# EasyEDA Pro project SRM_SuperCapacitor_S23_S24_.epro, board PCB1_3
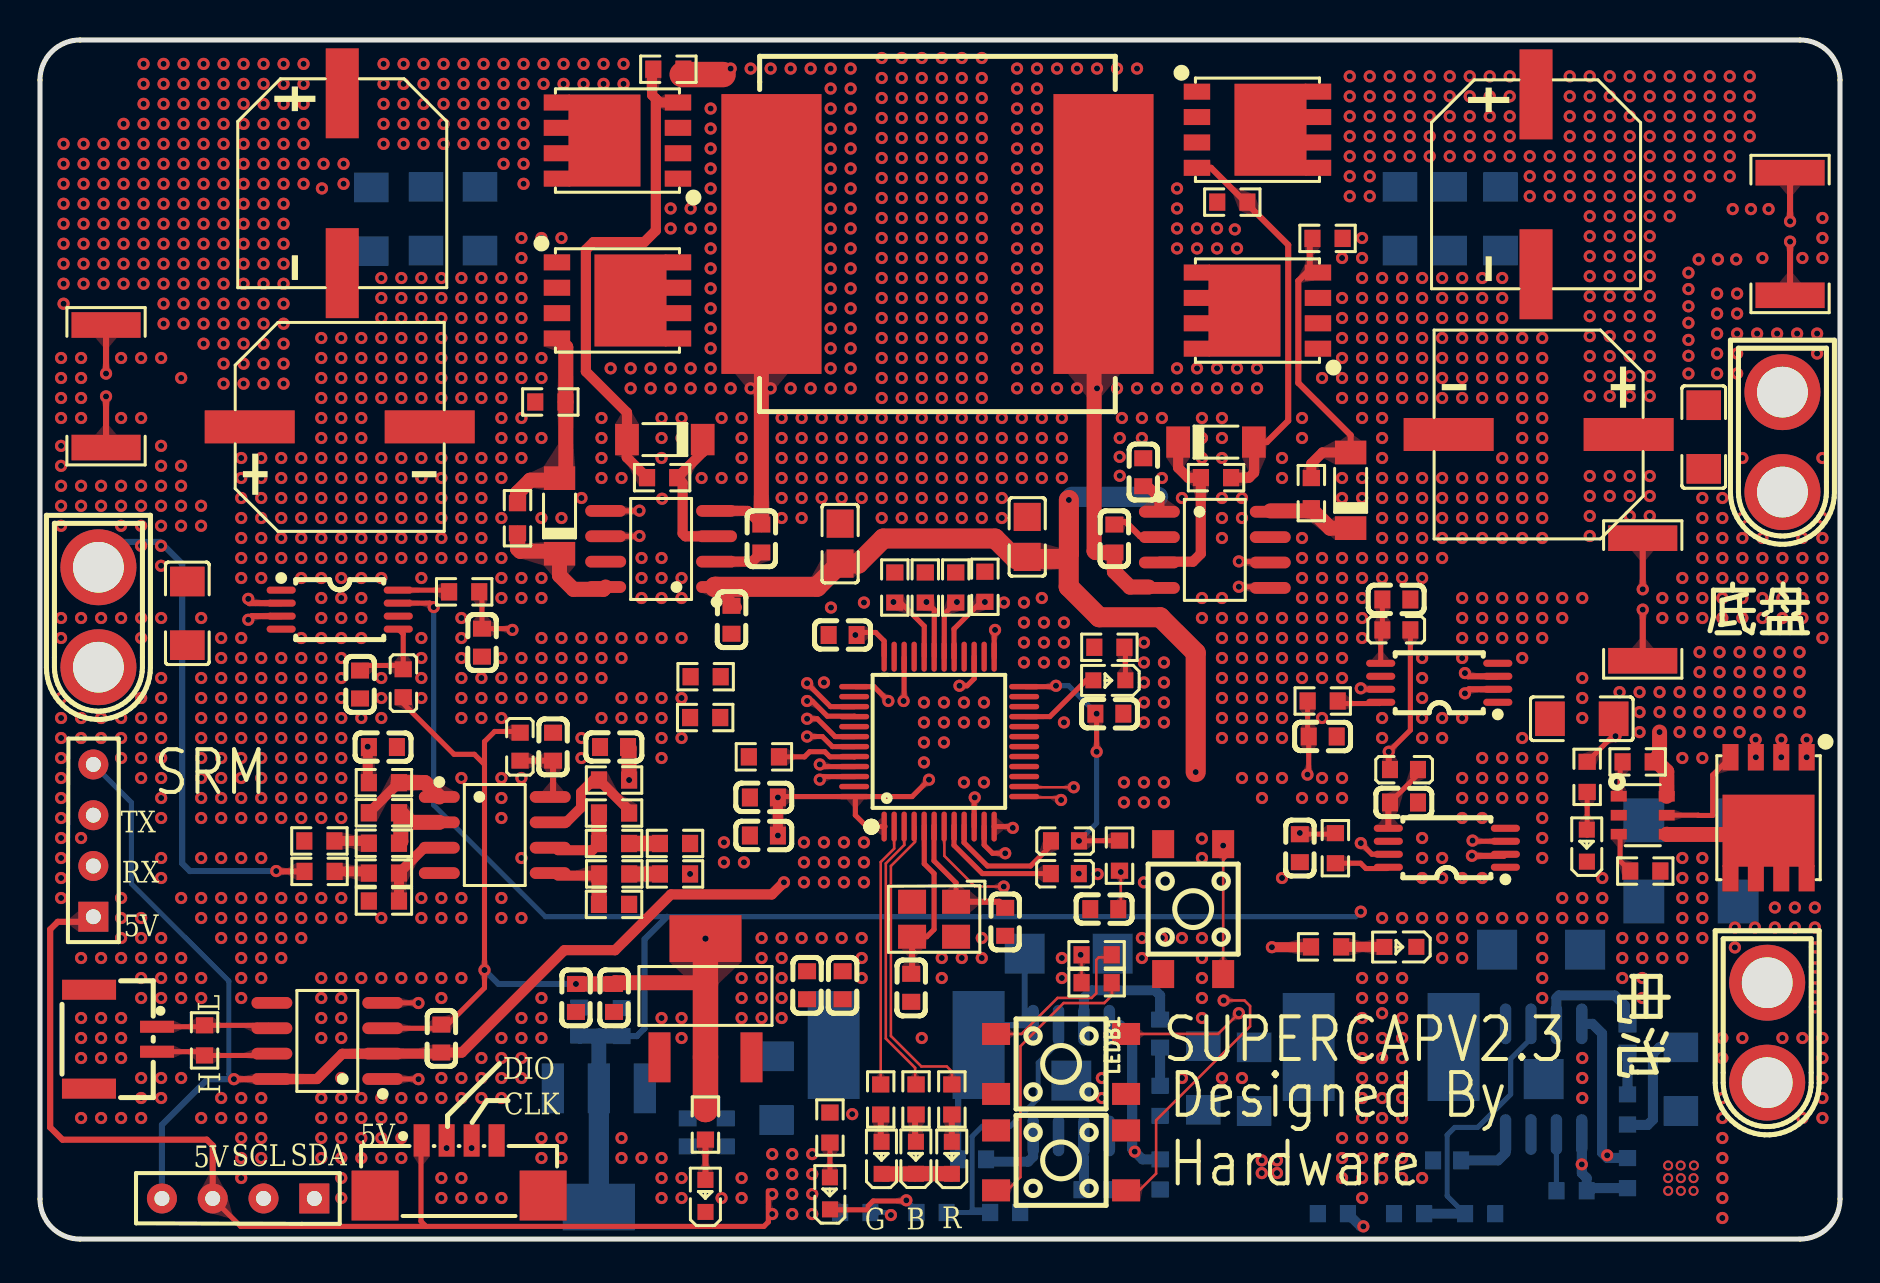
[diagram p3: board, top side]
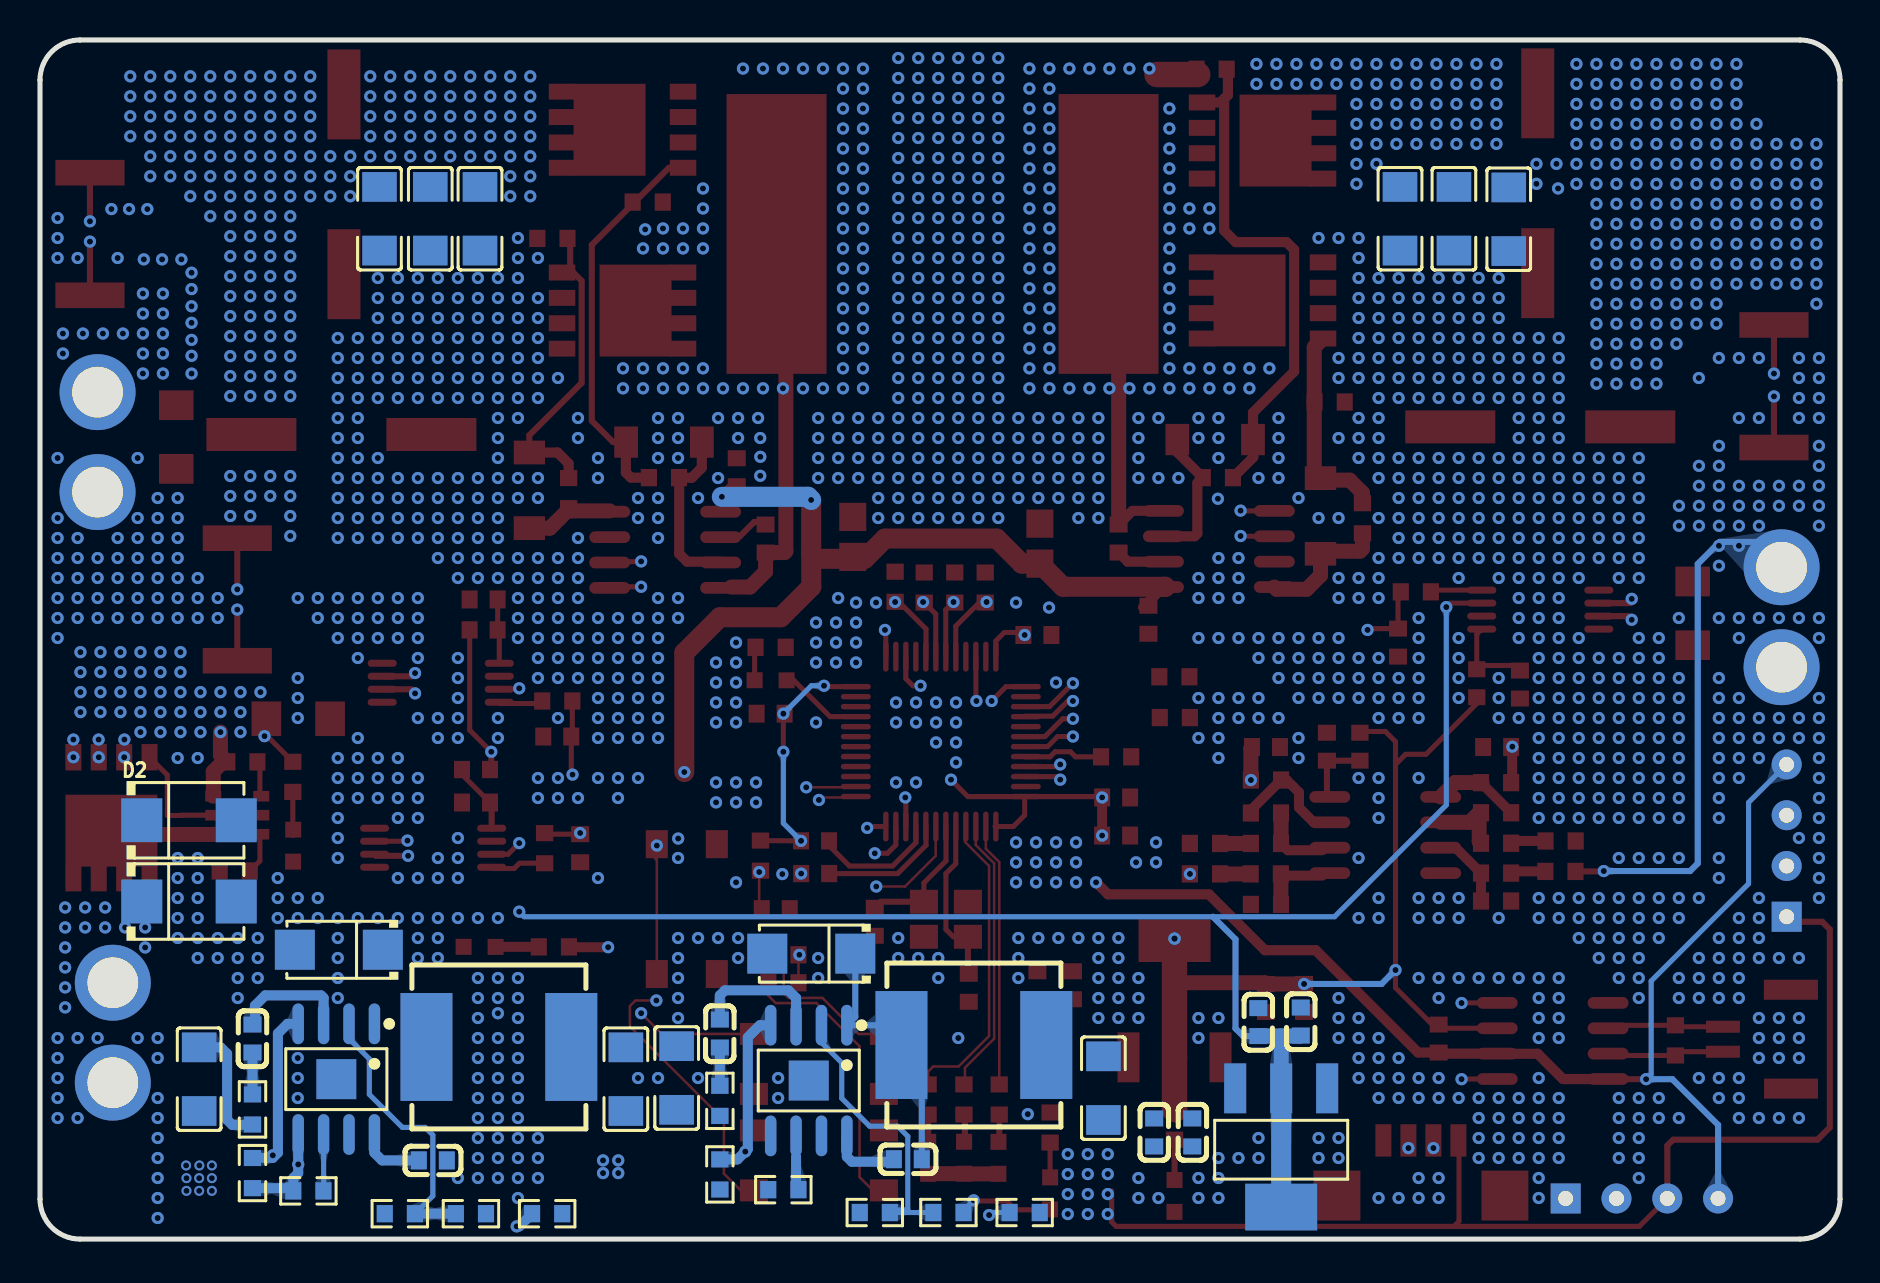
[diagram p4: board, bottom side, seen from below]

Outline 90 x 60 mm; copper layers: Top Layer, Inner1, Inner2, Bottom Layer. Coordinates in mm from the lower left corner of the outline.
Outline path: 0,58 0,2 arc(0.59,0.59) 2,0 88,0 arc(89.41,0.59) 90,2 90,58 arc(89.41,59.41) 88,60 2,60 arc(0.59,59.41) 0,58
Stack: Top Layer 0.035mm / Dielectric1 0.48mm PP er 4.5 / Inner1 0.035mm / Dielectric2 0.48mm FR4 er 4.5 / Inner2 0.035mm / Dielectric3 0.48mm PP er 4.5 / Bottom Layer 0.035mm

## Design rules (mm)
net INC-: DP7
net CAP_I+: DP8
net OUTC-: DP7
net CHB2: DP1
net CHB1: DP1
net CHA2: DP2
net UART2_RX: DP5
net CAN_RX: DP3
net UART2_TX: DP5
net CAN_TX: DP3
net SWCLK: DP4
net SWDIO: DP4
net CHA1: DP2
net SCL_PB6: DP6
net SDA_PB7: DP6
net CAP_I-: DP8
spacing safeClearance (default): track to track 0.102, other pairs 0.127 to 0.3
track width trackWidth (default): min 0.127, default 0.254, max 2.54
differential pair differentialPair (default): width min 0.025, default 0.254, max 2.54; gap min 0.025, default 0.152
via viaSize (default): diameter min 0.5, default 0.61, max 10; hole min 0.3, default 0.305, max 6

## Placement (name value [footprint] x y rotation side)
C1  100nF  [C0603]  20.07 10.03 270 top
C2  22pF  [C0603]  43.56 12.57 90 top
C3  22pF  [C0603]  48.26 15.87 90 top
C4  100nF  [C0603]  36.2 22.1 0 top
C5  100nF  [C0603]  40.13 30.23 0 top
C6  100nF  [C0603]  53.47 26.29 180 top
C7  100nF  [C0603]  36.2 20.19 0 top
C8  100nF  [C0603]  53.21 16.51 0 top
C9  150pF  [C0603]  56.01 10.28 90 bottom
C10  100nF  [C0603]  46.61 4 0 bottom
C11  22uF  [C1206]  36.83 7.55 270 bottom
C12  10uF  [C0603]  26.8 12.06 270 top
C13  100nF  [C0603]  28.7 12.06 270 top
C14  10uF  [C0603]  40.13 12.7 90 top
C15  100nF  [C0603]  38.35 12.7 90 top
C16  10uF  [C1206]  58.17 8.06 90 bottom
C17  100nF  [C0603]  32.39 5.33 270 bottom
C18  10uF  [C0603]  34.29 5.33 270 bottom
C19  100nF  [C0603]  26.96 10.89 90 bottom
C20  10uF  [C0603]  29.08 10.86 90 bottom
C24  100nF  [C0603]  64.14 25.15 0 top
C25  100nF  [C0603]  22.1 29.84 270 top
C26  100nF  [C0603]  62.99 19.56 270 top
C27  1uF  [C1206]  83.19 40.13 90 top
C28  100nF  [C0603]  67.82 32 0 top
C29  1uF  [C1206]  7.37 31.31 90 top
C30  100nF  [C0603]  16 27.75 270 top
C31  1uF  [C1206]  77.09 26.03 0 top
C32  100nF  [C0603]  68.2 21.84 0 top
C33  100nF  [C0603]  25.65 24.64 90 top
C34  47uF  [C1206]  19.3 51.05 90 bottom
C35  47uF  [C1206]  16.56 51.03 90 bottom
C36  47uF  [C1206]  22 51.05 90 bottom
C41  47uF  [C1206]  70.48 51.05 90 bottom
C42  47uF  [C1206]  73.02 51.05 90 bottom
C43  47uF  [C1206]  68 51.05 90 bottom
C44  100nF  [C0805]  40.01 34.8 270 top
C45  100nF  [C0805]  49.36 35.13 90 top
C46  1uF  [C0603]  36.07 35.05 90 top
C47  1uF  [C0603]  53.72 35.05 90 top
C48  150pF  [C0603]  79.38 10.03 90 bottom
C49  100nF  [C0603]  70.36 3.94 0 bottom
C50  22uF  [C1206]  60.71 8 270 bottom
C51  10uF  [C1206]  82.04 8 90 bottom
C52  100nF  [C0603]  17.14 24.62 180 top
C53  100nF  [C0603]  28.7 24.62 0 top
C54  220uF  [CAP-SMD_BD10.0-L10.3-W10.3-FD]  74.93 40.26 180 top
C55  220uF  [CAP-SMD_BD10.0-L10.3-W10.3-FD]  74.8 52.78 270 top
C56  220uF  [CAP-SMD_BD10.0-L10.3-W10.3-FD]  15.11 52.83 270 top
C57  220uF  [CAP-SMD_BD10.0-L10.3-W10.3-FD]  14.99 40.64 0 top
C58  100nF  [C0603]  55.16 38.37 270 top
C59  100nF  [C0603]  34.58 30.99 270 top
CN1  HC-1.25-4PLT  [CONN-SMD 4P-P1.25-L]  20.95 3.56 0 top
CN2  XT30U-M  [CONN-TH_XT30U-M]  2.92 31.11 270 top
CN3  XT30U-M  [CONN-TH_XT30U-M]  86.36 10.33 270 top
CN4  XT30U-M  [CONN-TH_XT30U-M]  87.12 39.88 270 top
D1  SS34  [SMA_L4.3-W2.6-LS5.2-RD]  51.44 14.28 0 bottom
D2  SMBJ28A  [SMB_L4.6-W3.6-LS5.3-RD]  82.55 20.95 180 bottom
D3  LL4148  [LL-34_L3.5-W1.5-R-RD]  31.24 40 180 top
D4  LL4148  [LL-34_L3.5-W1.5-R-RD]  58.8 39.88 0 top
D5  LL4148  [LL-34_L3.5-W1.5-R-RD]  25.98 36.18 90 top
D6  LL4148  [LL-34_L3.5-W1.5-R-RD]  65.53 37.46 90 top
D7  SS34  [SMA_L4.3-W2.6-LS5.2-RD]  75.06 14.48 0 bottom
D8  SMBJ28A  [SMB_L4.6-W3.6-LS5.3-RD]  82.55 16.89 180 bottom
L1  10mH  [L0603]  51.25 19.93 180 top
L2  10mH  [L0603]  51.24 18.29 180 top
L3  15uH  [IND-SMD_L8.2-W8.2]  43.31 9.71 0 bottom
L4  10mH  [L0603]  67.82 30.48 0 top
L5  10mH  [L0603]  18.16 27.81 270 top
L6  10mH  [L0603]  68.2 23.49 180 top
L7  10uH  [L0603]  24 24.64 90 top
L8  22uH  [IND-SMD_L17.5-W17.5]  44.87 50.29 0 top
L9  22uH  [IND-SMD_L8.2-W8.2]  67.06 9.61 0 bottom
LED1  -  [LED0603-RD_BLUE]  53.47 27.96 180 top
LED2  -  [LED0603-RD_BLUE]  77.34 19.68 90 top
LED3  -  [LED0603-RD_BLUE]  68.02 14.62 180 top
LED4  -  [LED0603-RD_BLUE]  39.5 2.29 90 top
LED5  -  [LED0603-RD_BLUE]  33.27 2.16 90 top
LEDB1  -  [LED0603-RD_BLUE]  45.59 4.06 90 top
LEDG1  -  [LED0603-RD_BLUE]  43.8 4.07 90 top
LEDR1  -  [LED0603-RD_BLUE]  42.08 4.06 90 top
Q1  CSD19534Q5A  [POWERVDFN-8_L6.0-W5.0-P1.27-BL]  28.87 54.97 90 top
Q2  CSD19534Q5A  [POWERVDFN-8_L6.0-W5.0-P1.27-BL]  60.87 55.51 270 top
Q3  CSD19534Q5A  [POWERVDFN-8_L6.0-W5.0-P1.27-BL]  28.87 46.97 270 top
Q4  CSD19534Q5A  [POWERVDFN-8_L6.0-W5.0-P1.27-BL]  60.87 46.46 90 top
Q5  CSD19534Q5A  [POWERVDFN-8_L6.0-W5.0-P1.27-BL]  86.43 21.08 180 top
R1  120R  [R0603]  8.23 9.94 270 top
R2  10K  [R0603]  36.2 24.13 180 top
R3  10K  [R0603]  53.47 29.61 180 top
R4  10K  [R0603]  53.98 19.19 90 top
R5  1K  [R0603]  42.04 6.98 90 top
R6  1K  [R0603]  43.8 6.99 90 top
R7  1K  [R0603]  45.59 6.98 90 top
R8  100K  [R0603]  56.01 6.92 90 bottom
R9  10K  [R0603]  52.83 2.47 180 bottom
R10  47R  [R0603]  64.14 26.92 180 top
R11  47R  [R0603]  21.21 32.38 0 top
R12  47R  [R0603]  64.77 19.56 90 top
R13  10mΩ  [R2512]  87.5 50.29 90 top
R14  10mΩ  [R2512]  80.14 32 90 top
R15  10mΩ  [R2512]  3.3 42.67 90 top
R16  2K  [R0603]  17.2 21.33 0 top
R17  2K  [R0603]  28.7 21.32 180 top
R18  20K  [R0603]  28.7 19.79 180 top
R19  20K  [R0603]  17.2 19.81 0 top
R20  20K  [R0603]  28.71 18.27 180 top
R21  20K  [R0603]  17.2 18.31 0 top
R22  2K  [R0603]  28.7 16.75 180 top
R23  2K  [R0603]  17.2 16.92 0 top
R24  0R  [R0603]  13.98 18.4 180 top
R25  0R  [R0603]  31.75 18.27 180 top
R26  10K  [R0603]  31.42 58.54 180 top
R27  10K  [R0603]  59.62 51.89 0 top
R28  0R  [R0603]  13.97 19.92 180 top
R29  0R  [R0603]  31.75 19.79 180 top
R30  10K  [R0603]  25.52 41.89 0 top
R31  10K  [R0603]  64.38 50.07 180 top
R34  100R  [R0603]  31.11 38.1 180 top
R35  100R  [R0603]  58.8 38.1 180 top
R36  10K  [R0603]  44.26 32.6 270 top
R37  10K  [R0603]  42.74 32.6 270 top
R38  10K  [R0603]  47.24 32.64 270 top
R39  10K  [R0603]  45.79 32.6 270 top
R40  100R  [R0603]  23.88 36.07 90 top
R41  100R  [R0603]  63.57 37.32 270 top
R42  100R  [R0603]  79.88 23.88 0 top
R43  100R  [R0603]  80.26 18.41 180 top
R44  0R  [R0603]  33.28 28.14 180 top
R45  0R  [R0603]  33.26 26.1 180 top
R46  147K  [R0603]  79.38 6.49 90 bottom
R47  10K  [R0603]  76.58 2.41 180 bottom
R48  100K  [R0603]  72.01 1.27 0 bottom
R49  24.9K  [R0603]  68.45 1.27 0 bottom
R50  140K  [R0603]  64.64 1.27 180 bottom
R51  10K  [R0603]  79.38 3.3 90 bottom
R52  100K  [R0603]  48.26 1.33 0 bottom
R53  24.9K  [R0603]  44.58 1.33 0 bottom
R54  210K  [R0603]  40.77 1.33 180 bottom
R55  40.2K  [R0603]  56.01 3.23 90 bottom
R56  10K  [R0603]  77.36 23.13 270 top
R57  10K  [R0603]  64.31 14.62 0 top
R58  10K  [R0603]  39.5 5.58 270 top
R59  10K  [R0603]  33.27 5.73 270 top
R60  10K  [R0603]  52.83 14.22 0 top
R61  10K  [R0603]  52.83 12.83 0 top
R62  470R  [R0603]  28.7 22.97 0 top
R63  470R  [R0603]  17.2 22.84 180 top
SW1  4.5*4.5*5  [SW-SMD_4P-L4.5-W4.5-P3.00-LS6.8]  57.66 16.51 270 top
SW2  4.5*4.5*5  [SW-SMD_4P-L4.5-W4.5-P3.00-LS6.8]  51.05 8.76 0 top
SW3  4.5*4.5*5  [SW-SMD_4P-L4.5-W4.5-P3.00-LS6.8]  51.05 3.94 0 top
U1  MAX3051ESA-T  [SOIC-8_L4.9-W3.9-P1.27-LS6.0-BL]  14.37 9.91 90 top
U2  JST_GH_BM02B-GHS-TBT_1x02-1MP_P1.25mm_Vertical  [CONN-SMD_2P-P1.25_GH1.25-2P]  4.15 10 270 top
U4  0.01  [排针2.54MM4P]  2.67 21.21 90 top
U5  STM32F334C8T6  [LQFP-48_L7.0-W7.0-P0.50-LS9.0-BL]  44.96 24.89 0 top
U6  0.01  [排针2.54MM4P]  8.64 2.03 180 top
U7  AMS1117-3.3  [SOT-223-3_L6.5-W3.4-P2.30-LS7.0-BR]  27.94 4.57 90 bottom
U16  INA240A2QPWRQ1  [TSSOP-8_L4.4-W3.0-P0.65-LS6.4-BL]  69.96 27.84 90 top
U17  INA240A2QPWRQ1  [TSSOP-8_L4.4-W3.0-P0.65-LS6.4-BL]  14.99 31.5 270 top
U18  INA240A2QPWRQ1  [TSSOP-8_L4.4-W3.0-P0.65-LS6.4-BL]  70.34 19.58 90 top
U19  UCC27211D  [SOIC-8_L4.9-W3.9-P1.27-LS6.0-BL]  31.06 34.53 90 top
U24  OPA2350UA/2K5  [SOIC-8_L4.9-W3.9-P1.27-LS6.0-BL]  22.74 20.22 270 top
U25  LM5050MK-1/NOPB  [TSOT-23-6_L2.9-W1.6-P0.95-LS2.8-BR]  80.14 21.21 180 top
U26  UCC27211D  [SOIC-8_L4.9-W3.9-P1.27-LS6.0-BL]  58.74 34.49 270 top
U29  MP4462DN-LF-Z  [SOIC-8_L5.0-W4.0-P1.27-LS6.0-BL-EP2.0]  75.18 8 0 bottom
U30  MP1584EN-LF-Z  [SOIC-8_L5.0-W4.0-P1.27-LS6.0-BL-EP2.0]  51.56 7.93 0 bottom
U31  AMS1117-3.3  [SOT-223-3_L6.5-W3.4-P2.30-LS7.0-BR]  33.27 12.06 270 top
X2  8MHz  [CRYSTAL-SMD_4P-L3.2-W2.5-BL-1]  44.7 16 180 top

## Footprints (pads in the part's own frame, mm; a bottom-side part is the same pattern mirrored in y, then rotated)
C0603
  rect 0.8x0.9 smd: 1(-0.7,0) 2(0.7,0)
C0805
  rect 1.41x1.35 smd: 1(-1,0) 2(1,0)
C1206
  rect 1.485x1.728 smd: 1(-1.593,0) 2(1.593,0)
CAP-SMD_BD10.0-L10.3-W10.3-FD
  rect 4.5x1.65 smd: 1(-4.5,0) 2(4.5,0)
CONN-SMD 4P-P1.25-L
  rect 0.8x1.621 smd: 1(-1.875,1.379) 2(-0.625,1.379) 3(0.625,1.379) 4(1.875,1.379)
  rect 2.349x2.499 smd: 5(-4.201,-1.379) 6(4.201,-1.379)
CONN-SMD_2P-P1.25_GH1.25-2P
  rect 0.6x1.7 smd: 1(-0.625,1.702) 2(0.625,1.702)
  rect 1.001x2.7 smd: 3(2.474,-1.702) 4(-2.474,-1.696)
CONN-TH_XT30U-M
  round 3.8 hole 2.54: 1(-2.5,0) 2(2.5,0)
CRYSTAL-SMD_4P-L3.2-W2.5-BL-1
  rect 1.4x1.2 smd: 1(-1.1,-0.875) 2(1.1,-0.875) 3(1.1,0.875) 4(-1.1,0.875)
IND-SMD_L8.2-W8.2
  rect 2.6x5.4 smd: 1(-3.62,0) 2(3.62,0)
IND-SMD_L17.5-W17.5
  rect 5.002x14.001 smd: 1(-8.3,0) 2(8.3,0)
L0603
  rect 0.8x0.864 smd: 1(-0.7,0) 2(0.7,0)
LED0603-RD_BLUE
  rect 0.8x0.8 smd: 1(-0.8,-0.003) 2(0.8,0.003)
LL-34_L3.5-W1.5-R-RD
  rect 1.186x1.567 smd: 1(1.893,0) 2(-1.893,0)
LQFP-48_L7.0-W7.0-P0.50-LS9.0-BL
  oval 0.27x1.5 smd: 1(-2.75,-4.25) 2(-2.25,-4.25) 3(-1.75,-4.25) 4(-1.25,-4.25) 5(-0.75,-4.25) 6(-0.25,-4.25) 7(0.25,-4.25) 8(0.75,-4.25) 9(1.25,-4.25) 10(1.75,-4.25) 11(2.25,-4.25) 12(2.75,-4.25) 25(2.75,4.25) 26(2.25,4.25) 27(1.75,4.25) 28(1.25,4.25) 29(0.75,4.25) 30(0.25,4.25) 31(-0.25,4.25) 32(-0.75,4.25) 33(-1.25,4.25) 34(-1.75,4.25) 35(-2.25,4.25) 36(-2.75,4.25)
  oval 1.5x0.27 smd: 13(4.25,-2.75) 14(4.25,-2.25) 15(4.25,-1.75) 16(4.25,-1.25) 17(4.25,-0.75) 18(4.25,-0.25) 19(4.25,0.25) 20(4.25,0.75) 21(4.25,1.25) 22(4.25,1.75) 23(4.25,2.25) 24(4.25,2.75) 37(-4.25,2.75) 38(-4.25,2.25) 39(-4.25,1.75) 40(-4.25,1.25) 41(-4.25,0.75) 42(-4.25,0.25) 43(-4.25,-0.25) 44(-4.25,-0.75) 45(-4.25,-1.25) 46(-4.25,-1.75) 47(-4.25,-2.25) 48(-4.25,-2.75)
POWERVDFN-8_L6.0-W5.0-P1.27-BL
  rect 0.8x1.321 smd: 1(-1.905,-3.026) 2(-0.635,-3.026) 3(0.635,-3.026) 4(1.905,-3.026) 5(1.905,3.026) 6(0.635,3.026) 7(-0.635,3.026) 8(-1.905,3.026)
  rect 4.6x3.6 smd: 9(0,0.65)
R0603
  rect 0.806x0.864 smd: 1(-0.753,0) 2(0.753,0)
R2512
  rect 1.282x3.456 smd: 1(-3.067,0) 2(3.067,0)
SMA_L4.3-W2.6-LS5.2-RD
  rect 2x2 smd: 1(-2.2,0) 2(2.2,0)
SMB_L4.6-W3.6-LS5.3-RD
  rect 2.047x2.192 smd: 1(-2.361,0) 2(2.361,0)
SOIC-8_L4.9-W3.9-P1.27-LS6.0-BL
  oval 0.588x2.045 smd: 1(-1.905,-2.772) 2(-0.635,-2.772) 3(0.635,-2.772) 4(1.905,-2.772) 5(1.905,2.772) 6(0.635,2.772) 7(-0.635,2.772) 8(-1.905,2.772)
SOIC-8_L5.0-W4.0-P1.27-LS6.0-BL-EP2.0
  oval 0.574x2.038 smd: 1(-1.905,-2.769) 2(-0.635,-2.769) 3(0.635,-2.769) 4(1.905,-2.769) 5(1.905,2.769) 6(0.635,2.769) 7(-0.635,2.769) 8(-1.905,2.769)
  rect 2x2 smd: 9(0,0)
SOT-223-3_L6.5-W3.4-P2.30-LS7.0-BR
  rect 2.5x1.1 smd: 1(2.97,-2.3) 2(2.97,0) 3(2.97,2.3)
  rect 2.34x3.6 smd: 4(-2.97,0)
SW-SMD_4P-L4.5-W4.5-P3.00-LS6.8
  rect 1.4x1.1 smd: 1(-3.25,1.5) 2(3.25,1.5) 3(-3.25,-1.5) 4(3.25,-1.5)
TSOT-23-6_L2.9-W1.6-P0.95-LS2.8-BR
  rect 0.8x0.531 smd: 1(1.199,-0.95) 2(1.199,0) 3(1.199,0.95) 4(-1.199,0.95) 5(-1.199,0) 6(-1.199,-0.95)
TSSOP-8_L4.4-W3.0-P0.65-LS6.4-BL
  oval 0.353x1.454 smd: 1(-0.975,-2.927) 2(-0.325,-2.927) 3(0.325,-2.927) 4(0.975,-2.927) 5(0.975,2.927) 6(0.325,2.927) 7(-0.325,2.927) 8(-0.975,2.927)
排针2.54MM4P
  rect 1.5x1.5 hole 0.75: 1(-5.08,0)
  round 1.5 hole 0.75: 2(-2.54,0) 3(0,0) 4(2.54,0)

## Nets
As in the schematic.

Pads without a net: SW2 4; SW3 2; U1 5; U5 15 16 17 18 19 20 22 26 28 33 38 41; X2 2 4

## Via types
v1: diameter 0.61, hole 0.305, Top Layer to Bottom Layer, 1347 vias
v2: diameter 0.61, hole 0.3, Top Layer to Bottom Layer, 22 vias
v3: diameter 0.61, hole 0.304, Top Layer to Bottom Layer, 697 vias
v4: diameter 0.5, hole 0.3, Top Layer to Bottom Layer, 9 vias

## Routing (per net, layer and track width the routed paths; a pad name or vN(x,y) marks a point on that pad's centre or on a via; arc(x,y) is an arc through that point)
3.3VA: length 130.9
  Top Layer w0.127: R60.1 R61.1 ; v1(51.95,19.93) 51.94,19.93
  Top Layer w0.254: 40.75,22.14 43.61,22.14 v1(44.45,22.99) ; 40.75,22.14 40.77,22.12 40.77,21.21 41.33,20.64 42.25,20.64 ; 40.75,22.14 36.94,22.14 v2(36.89,22.1) ; 42.21,29.18 42.21,29.93 41.78,30.35 40.83,30.35 ; 18.03,27.11 18.03,26.92 20.7,24.26 21.72,24.26 22.23,23.75 ; 22.23,23.75 v1(22.23,13.46) 22.23,12.57 20.2,10.55 17.14,10.55 ; 22.23,23.75 22.23,24.89 22.73,25.4 23.94,25.4 L7.2 ; v1(52.83,24.38) 52.83,26.22 C6.2 v1(52.83,26.29) ; v2(40.77,30.23) 40.83,30.23 ; 51.94,19.93 R4.2 ; L4.2 68.52,25.46 v1(67.44,24.38) ; 49.25,27.64 50.76,27.64 v1(50.8,27.69)
  Top Layer w0.305: L6.2 67.44,23.56 v1(67.44,24.38)
  Top Layer w0.5: v2(36.89,20.19) v2(36.89,22.1)
  Top Layer w0.75: 33.27,12.76 33.21,12.83 28.76,12.83 C13.1 v1(26.8,12.76)
  Top Layer w1.27: v2(33.27,15.03) U31.2 33.27,6.48 R59.1
  Inner1 w0.127: v2(52.03,14.22) 51.23,15.02 51.23,19.21 v1(51.95,19.93)
  Inner1 w0.508: v2(33.27,15.03) 36.89,18.66 v2(36.89,20.19)
  Inner2 w0.254: v2(40.77,30.23) 37.34,30.23 36.89,29.78 v2(36.89,22.1) ; v1(52.83,24.38) 45.85,24.38 v1(44.45,22.99)
  Inner2 w0.305: v1(52.83,24.38) v1(67.44,24.38)
  Bottom Layer w0.254: v1(50.8,27.69) 51.44,27.69 v1(52.83,26.29) ; v1(51.95,19.93) 52.83,20.81 v1(52.83,24.38)
  Bottom Layer w0.305: v1(22.23,13.46) 22.92,12.76 v1(26.8,12.76)
+5V: length 57.9
  Top Layer w0.254: 19.3,0.63 10.03,0.63 U6.3 ; 19.3,0.63 19.05,0.89 19.05,4.9 CN1.1 ; 19.3,0.63 36.2,0.63 36.42,0.86 36.42,2.41
  Top Layer w0.305: U4.1 2.41,15.87 0.89,15.87 0.51,15.49 0.51,5.59 1.12,4.97 8.34,4.97 8.64,4.68 U6.3
  vias: v3(36.61,4.25) v3(36.61,3.25) v3(36.61,2.25) v3(36.61,1.25) v3(37.61,4.25) v3(37.61,3.25) v3(37.61,2.25) v3(37.61,1.25) v3(38.61,4.25) v3(38.61,3.25) v3(38.61,2.25) v3(38.61,1.25) v3(40.61,6.25)
+12V: length 69.1
  Top Layer w0.5: v1(61.6,14.6) 63.54,14.6 R57.1
  Top Layer w0.508: 55.18,37.57 55.47,37.57 v2(55.91,37.14) 55.97,37.08 55.97,36.5 ; 34.85,31.61 33.82,32.64
  Top Layer w1.001: 33.73,32.63 33.74,32.64 38.85,32.64 C44.2 40.91,33.8 42.16,35.05 47.75,35.05 48.77,34.04 51.17,34.04 51.44,34.3 ; v2(51.44,36.98) 51.44,34.31 51.44,34.3 ; 51.44,34.3 51.44,32.64 52.96,31.11 56.01,31.11 57.79,29.34 v2(57.79,23.37)
  Inner1 w1: 58.8,22.35 60.23,20.92 60.23,15.97 v1(61.6,14.6) 61.6,3.17 61.21,3.17 v1(61.09,3.3)
  Inner1 w1.001: 58.8,22.35 v2(57.79,23.37)
  Bottom Layer w1.001: v2(51.44,36.98) 51.6,37.14 v2(55.91,37.14)
  vias: v1(61.09,3.94) v1(61.85,3.94) v1(61.85,3.3)
AGND: length 16.1
  Top Layer w0.254: 41.4,1.65 41.66,1.9 43.28,1.9 v2(43.32,1.94) ; 39.65,1.46 41.39,1.46 ; LED4.1 39.66,1.65
  Bottom Layer w0.254: v2(43.32,1.94) 43.82,1.43 R53.1
  Bottom Layer w0.5: 79.38,5.73 79.39,5.71 80.39,5.71 80.64,5.97 80.64,9.27 80.97,9.59 C51.2 ; U29.5 v1(77.09,3.74) 77.09,3.3 77.33,3.06 R47.1 77.47,2.55 R51.1
  vias: v1(1.05,44.09) v1(1.05,43.09) v1(1.05,42.09) v1(1.05,41.08) v1(1.05,31.08) v1(1.05,30.08) v1(1.05,27.07) v1(1.05,26.07) v1(1.05,25.07) v1(1.05,24.07) v1(1.05,23.07) v1(1.05,22.07) v1(1.05,21.07) v1(1.05,20.07) v1(1.05,19.07) v1(1.05,18.07) v1(1.05,17.07) v1(2.06,44.09) v1(2.06,43.09) v1(2.06,42.09) v1(2.06,41.08) v1(2.06,31.08) v1(2.06,26.07) v1(2.06,25.07) v1(2.06,20.07) v1(2.06,14.06) v1(2.06,11.06) v1(2.06,10.06) v1(2.06,9.06) v1(2.06,6.06) v1(3.06,31.08) v1(3.06,26.07) v1(3.06,25.07) v1(3.06,14.06) v1(3.06,11.06) v1(3.06,10.06) v1(3.06,9.06) v1(3.06,6.06) v1(4.06,44.09) v1(4.06,41.08) v1(4.06,31.08) v1(4.06,26.07) v1(4.06,25.07) v1(4.06,24.07) v1(4.06,17.07) v1(4.06,16.07) v1(4.06,15.06) v1(4.06,14.06) v1(4.06,11.06) v1(4.06,10.06) v1(4.06,9.06) v1(4.06,6.06) v1(5.06,44.09) v1(5.06,41.08) v1(5.06,31.08) v1(5.06,30.08) v1(5.06,27.07) v1(5.06,26.07) v1(5.06,25.07) v1(5.06,24.07) v1(5.06,23.07) v1(5.06,16.07) v1(5.06,15.06) v1(5.06,14.06) v1(5.06,13.06) v1(5.06,12.06) v1(5.06,8.06) v1(5.06,7.06) v1(5.06,6.06) v1(6.06,44.09) v1(6.06,31.08) v1(6.06,28.07) v1(6.06,27.07) v1(6.06,26.07) v1(6.06,25.07) v1(6.06,24.07) v1(6.06,23.07) v1(6.06,22.07) v1(6.06,21.07) v1(6.06,19.07) v1(6.06,18.07) v1(6.06,15.06) v1(6.06,14.06) v1(6.06,13.06) v1(6.06,12.06) v1(6.06,8.06) v1(6.06,7.06) v1(7.06,43.09) v1(7.06,17.07) v1(7.06,14.06) v1(7.06,13.06) v1(7.06,12.06) v1(7.06,8.06) v1(8.06,31.08) v1(8.06,28.07) v1(8.06,27.07) v1(8.06,26.07) v1(8.06,25.07) v1(8.06,24.07) v1(8.06,23.07) v1(8.06,22.07) v1(8.06,21.07) v1(8.06,19.07) v1(8.06,17.07) v1(8.06,16.07) v1(8.06,13.06) v1(8.06,12.06) v1(8.06,6.06) v1(9.06,30.08) v1(9.06,29.08) v1(9.06,28.07) v1(9.06,27.07) v1(9.06,26.07) v1(9.06,25.07) v1(9.06,24.07) v1(9.06,23.07) v1(9.06,22.07) v1(9.06,21.07) v1(9.06,19.07) v1(9.06,17.07) v1(9.06,16.07) v1(9.06,15.06) v1(9.06,7.06) v1(9.06,6.06) v1(10.06,39.08) v1(10.06,38.08) v1(10.06,37.08) v1(10.06,36.08) v1(10.06,35.08) v1(10.06,34.08) v1(10.06,33.08) v1(10.06,30.08) v1(10.06,29.08) v1(10.06,28.07) v1(10.06,27.07) v1(10.06,26.07) v1(10.06,25.07) v1(10.06,24.07) v1(10.06,23.07) v1(10.06,22.07) v1(10.06,21.07) v1(10.06,19.07) v1(10.06,17.07) v1(10.06,16.07) v1(10.06,15.06) v1(10.06,14.06) v1(10.06,13.06) v1(10.06,12.06) v1(10.06,7.06) v1(10.06,6.06) v1(10.06,5.06) v1(10.06,4.06) v1(10.06,3.06) v1(11.06,39.08) v1(11.06,38.08) v1(11.06,37.08) v1(11.06,36.08) v1(11.06,35.08) v1(11.06,34.08) v1(11.06,33.08) v1(11.06,29.08) v1(11.06,28.07) v1(11.06,27.07) v1(11.06,26.07) v1(11.06,25.07) v1(11.06,24.07) v1(11.06,23.07) v1(11.06,22.07) v1(11.06,21.07) v1(11.06,19.07) v1(11.06,17.07) v1(11.06,16.07) v1(11.06,15.06) v1(11.06,14.06) v1(11.06,13.06) v1(11.06,7.06) v1(11.06,6.06) v1(11.06,5.06) v1(11.06,4.06) v1(12.06,39.08) v1(12.06,38.08) v1(12.06,37.08) v1(12.06,36.08) v1(12.06,35.08) v1(12.06,34.08) v1(12.06,29.08) v1(12.06,28.07) v1(12.06,27.07) v1(12.06,26.07) v1(12.06,25.07) v1(12.06,24.07) v1(12.06,23.07) v1(12.06,22.07) v1(12.06,21.07) v1(12.06,17.07) v1(12.06,16.07) v1(12.06,15.06) v1(12.06,14.06) v1(13.06,39.08) v1(13.06,38.08) v1(13.06,37.08) v1(13.06,36.08) v1(13.06,35.08) v1(13.06,34.08) v1(13.06,33.08) v1(13.06,30.08) v1(13.06,29.08) v1(13.06,28.07) v1(13.06,27.07) v1(13.06,26.07) v1(13.06,25.07) v1(13.06,24.07) v1(13.06,23.07) v1(13.06,22.07) v1(13.06,21.07) v1(13.06,17.07) v1(13.06,16.07) v1(13.06,15.06) v1(14.06,45.09) v1(14.06,44.09) v1(14.06,43.09) v1(14.06,42.09) v1(14.06,41.08) v1(14.06,40.08) v1(14.06,39.08) v1(14.06,38.08) v1(14.06,37.08) v1(14.06,36.08) v1(14.06,35.08) v1(14.06,34.08) v1(14.06,33.08) v1(14.06,32.08) v1(14.06,31.08) v1(14.06,30.08) v1(14.06,29.08) v1(14.06,28.07) v1(14.06,27.07) v1(14.06,26.07) v1(14.06,25.07) v1(14.06,24.07) v1(14.06,23.07) v1(14.06,22.07) v1(14.06,21.07) v1(14.06,17.07) v1(14.06,16.07) v1(14.06,13.06) v1(14.06,12.06) v1(14.06,11.06) v1(14.06,10.06) v1(14.06,7.06) v1(14.06,6.06) v1(14.06,5.06) v1(14.06,4.06) v1(15.06,45.09) v1(15.06,44.09) v1(15.06,43.09) v1(15.06,42.09) v1(15.06,41.08) v1(15.06,40.08) v1(15.06,39.08) v1(15.06,38.08) v1(15.06,37.08) v1(15.06,36.08) v1(15.06,35.08) v1(15.06,34.08) v1(15.06,33.08) v1(15.06,32.08) v1(15.06,31.08) v1(15.06,30.08) v1(15.06,29.08) v1(15.06,28.07) v1(15.06,27.07) v1(15.06,26.07) v1(15.06,25.07) v1(15.06,24.07) v1(15.06,23.07) v1(15.06,22.07) v1(15.06,21.07) v1(15.06,17.07) v1(15.06,16.07) v1(15.06,13.06) v1(15.06,12.06) v1(15.06,11.06) v1(15.06,10.06) v1(15.06,8.06) v1(15.06,7.06) v1(15.06,6.06) v1(15.06,5.06) v1(15.06,4.06) v1(15.06,3.06) v1(15.06,2.05) v1(16.07,45.09) v1(16.07,44.09) v1(16.07,43.09) v1(16.07,42.09) v1(16.07,41.08) v1(16.07,40.08) v1(16.07,39.08) v1(16.07,38.08) v1(16.07,37.08) v1(16.07,36.08) v1(16.07,35.08) v1(16.07,34.08) v1(16.07,33.08) v1(16.07,32.08) v1(16.07,31.08) v1(16.07,30.08) v1(16.07,26.07) v1(16.07,13.06) v1(16.07,7.06) v1(16.07,6.06) v1(16.07,5.06) v1(16.07,4.06) v1(17.07,48.09) v1(17.07,47.09) v1(17.07,46.09) v1(17.07,45.09) v1(17.07,44.09) v1(17.07,43.09) v1(17.07,42.09) v1(17.07,39.08) v1(17.07,38.08) v1(17.07,37.08) v1(17.07,36.08) v1(17.07,35.08) v1(17.07,34.08) v1(17.07,33.08) v1(17.07,28.07) v1(17.07,27.07) v1(17.07,26.07) v1(17.07,16.07) v1(17.07,13.06) v1(17.07,7.06) v1(17.07,6.06) v1(17.07,5.06) v1(17.07,4.06) v1(18.07,48.09) v1(18.07,47.09) v1(18.07,46.09) v1(18.07,45.09) v1(18.07,44.09) v1(18.07,43.09) v1(18.07,42.09) v1(18.07,39.08) v1(18.07,38.08) v1(18.07,37.08) v1(18.07,36.08) v1(18.07,35.08) v1(18.07,34.08) v1(18.07,13.06) v1(18.07,7.06) v1(18.07,6.06) v1(18.07,5.06) v1(18.07,4.06) v1(19.07,48.09) v1(19.07,47.09) v1(19.07,46.09) v1(19.07,45.09) v1(19.07,44.09) v1(19.07,43.09) v1(19.07,42.09) v1(19.07,39.08) v1(19.07,38.08) v1(19.07,37.08) v1(19.07,36.08) v1(19.07,35.08) v1(19.07,34.08) v1(19.07,33.08) v1(19.07,30.08) v1(19.07,29.08) v1(19.07,28.07) v1(19.07,27.07) v1(19.07,17.07) v1(19.07,16.07) v1(19.07,13.06) v1(19.07,7.06) v1(20.07,48.09) v1(20.07,47.09) v1(20.07,46.09) v1(20.07,45.09) v1(20.07,44.09) v1(20.07,43.09) v1(20.07,42.09) v1(20.07,39.08) v1(20.07,38.08) v1(20.07,37.08) v1(20.07,36.08) v1(20.07,35.08) v1(20.07,34.08) v1(20.07,17.07) v1(20.07,16.07) v1(20.07,13.06) v1(20.07,12.06) v1(20.07,8.06) v1(20.07,7.06) v1(20.07,3.06) v1(20.07,2.05) v1(21.07,48.09) v1(21.07,47.09) v1(21.07,46.09) v1(21.07,45.09) v1(21.07,44.09) v1(21.07,43.09) v1(21.07,42.09) v1(21.07,39.08) v1(21.07,38.08) v1(21.07,37.08) v1(21.07,36.08) v1(21.07,35.08) v1(21.07,34.08) v1(21.07,31.08) v1(21.07,30.08) v1(21.07,29.08) v1(21.07,28.07) v1(21.07,27.07) v1(21.07,26.07) v1(21.07,23.07) v1(21.07,17.07) v1(21.07,16.07) v1(21.07,13.06) v1(21.07,8.06) v1(21.07,7.06) v1(21.07,3.06) v1(21.07,2.05) v1(22.07,48.09) v1(22.07,47.09) v1(22.07,46.09) v1(22.07,45.09) v1(22.07,44.09) v1(22.07,43.09) v1(22.07,42.09) v1(22.07,39.08) v1(22.07,38.08) v1(22.07,37.08) v1(22.07,36.08) v1(22.07,35.08) v1(22.07,34.08) v1(22.07,28.07) v1(22.07,27.07) v1(22.07,26.07) v1(22.07,9.06) v1(22.07,8.06) v1(22.07,7.06) v1(22.07,2.05) v1(23.07,48.09) v1(23.07,47.09) v1(23.07,46.09) v1(23.07,45.09) v1(23.07,44.09) v1(23.07,43.09) v1(23.07,42.09) v1(23.07,41.08) v1(23.07,40.08) v1(23.07,39.08) v1(23.07,38.08) v1(23.07,36.08) v1(23.07,34.08) v1(23.07,33.08) v1(23.07,32.08) v1(23.07,29.08) v1(23.07,28.07) v1(23.07,27.07) v1(23.07,26.07) v1(23.07,23.07) v1(23.07,22.07) v1(23.07,21.07) v1(23.07,17.07) v1(23.07,16.07) v1(23.07,10.06) v1(23.07,9.06) v1(23.07,8.06) v1(23.07,7.06) v1(23.07,2.05) v1(24.07,50.09) v1(24.07,49.09) v1(24.07,48.09) v1(24.07,47.09) v1(24.07,46.09) v1(24.07,45.09) v1(24.07,44.09) v1(24.07,43.09) v1(24.07,41.08) v1(24.07,40.08) v1(24.07,39.08) v1(24.07,33.08) v1(24.07,32.08) v1(24.07,29.08) v1(24.07,28.07) v1(24.07,27.07) v1(24.07,23.07) v1(24.07,19.07) v1(24.07,16.07) v1(24.07,11.06) v1(24.07,10.06) v1(24.07,9.06) v1(24.07,8.06) v1(25.07,50.09) v1(25.07,44.09) v1(25.07,43.09) v1(25.07,40.08) v1(25.07,36.08) v1(25.07,33.08) v1(25.07,32.08) v1(25.07,30.08) v1(25.07,29.08) v1(25.07,28.07) v1(25.07,27.07) v1(25.07,12.06) v1(25.07,11.06) v1(25.07,10.06) v1(25.07,5.06) v1(25.07,4.06) v1(26.07,50.09) v1(26.07,36.08) v1(26.07,30.08) v1(26.07,29.08) v1(26.07,28.07) v1(26.07,27.07) v1(26.07,5.06) v1(26.07,4.06) v1(27.07,37.08) v1(27.07,30.08) v1(27.07,29.08) v1(27.07,28.07) v1(27.07,27.07) v1(27.07,25.07) v1(27.07,24.07) v1(28.07,41.08) v1(28.07,40.08) v1(28.07,39.08) v1(28.07,38.08) v1(28.07,30.08) v1(28.07,29.08) v1(28.07,28.07) v1(28.07,26.07) v1(29.08,38.08) v1(29.08,30.08) v1(29.08,29.08) v1(29.08,27.07) v1(29.08,26.07) v1(29.08,5.06) v1(29.08,4.06) v1(30.08,34.08) v1(30.08,33.08) v1(30.08,32.08) v1(30.08,30.08) v1(30.08,27.07) v1(30.08,26.07) v1(30.08,4.06) v1(31.08,41.08) v1(31.08,40.08) v1(31.08,39.08) v1(31.11,37.04) v1(31.08,34.08) v1(31.08,33.08) v1(31.08,32.08) v1(31.08,30.08) v1(31.08,27.07) v1(31.08,26.07) v1(31.08,25.07) v1(31.08,24.07) v1(31.08,11.06) v1(31.08,4.06) v1(31.08,3.06) v1(31.08,2.05) v1(32.08,41.08) v1(32.08,40.08) v1(32.08,33.08) v1(32.08,32.08) v1(32.08,30.08) v1(32.08,27.07) v1(32.08,25.07) v1(32.08,11.06) v1(32.08,10.06) v1(32.08,3.06) v1(32.08,2.05) v1(33.08,38.08) v1(34.08,41.08) v1(34.08,38.08) v1(34.08,2.05) v1(35.08,41.08) v1(35.08,40.08) v1(35.08,39.08) v1(35.08,38.08) v1(35.08,13.06) v1(35.08,12.06) v1(35.08,11.06) v1(35.08,3.06) v1(35.08,2.05) v1(36.08,15.06) v1(36.08,14.06) v1(36.08,13.06) v1(36.08,12.06) v1(36.08,11.06) v1(37.08,41.08) v1(37.08,40.08) v1(37.08,39.08) v1(37.08,38.08) v1(37.08,37.08) v1(37.08,36.08) v1(37.08,15.06) v1(37.08,14.06) v1(37.08,13.06) v1(37.08,12.06) v1(37.08,11.06) v1(38.08,41.08) v1(38.08,40.08) v1(38.08,39.08) v1(38.08,38.08) v1(38.08,37.08) v1(38.08,36.08) v1(38.08,15.06) v1(39.08,41.08) v1(39.08,40.08) v1(39.08,39.08) v1(39.08,38.08) v1(39.08,37.08) v1(39.08,15.06) v1(40.08,41.08) v1(40.08,40.08) v1(40.08,39.08) v1(40.08,38.08) v1(40.08,37.08) v1(40.08,15.06) v1(41.08,41.08) v1(41.08,40.08) v1(41.08,39.08) v1(41.08,38.08) v1(41.08,37.08) v1(41.08,15.06) v1(41.08,14.06) v1(41.08,13.06) v1(42.09,59.1) v1(42.09,58.1) v1(42.09,57.1) v1(42.09,56.1) v1(42.09,55.09) v1(42.09,54.09) v1(42.09,53.09) v1(42.09,52.09) v1(42.09,51.09) v1(42.09,50.09) v1(42.09,49.09) v1(42.09,48.09) v1(42.09,47.09) v1(42.09,46.09) v1(42.09,45.09) v1(42.09,44.09) v1(42.09,43.09) v1(42.09,42.09) v1(42.09,41.08) v1(42.09,40.08) v1(42.09,39.08) v1(42.09,38.08) v1(42.09,37.08) v1(42.09,36.08) v1(43.09,59.1) v1(43.09,58.1) v1(43.09,57.1) v1(43.09,56.1) v1(43.09,55.09) v1(43.09,54.09) v1(43.09,53.09) v1(43.09,52.09) v1(43.09,51.09) v1(43.09,50.09) v1(43.09,49.09) v1(43.09,48.09) v1(43.09,47.09) v1(43.09,46.09) v1(43.09,45.09) v1(43.09,44.09) v1(43.09,43.09) v1(43.09,42.09) v1(43.09,41.08) v1(43.09,40.08) v1(43.09,39.08) v1(43.09,38.08) v1(43.09,37.08) v1(43.09,36.08) v1(44.09,59.1) v1(44.09,58.1) v1(44.09,57.1) v1(44.09,56.1) v1(44.09,55.09) v1(44.09,54.09) v1(44.09,53.09) v1(44.09,52.09) v1(44.09,51.09) v1(44.09,50.09) v1(44.09,49.09) v1(44.09,48.09) v1(44.09,47.09) v1(44.09,46.09) v1(44.09,45.09) v1(44.09,44.09) v1(44.09,43.09) v1(44.09,42.09) v1(44.09,41.08) v1(44.09,40.08) v1(44.09,39.08) v1(44.09,38.08) v1(44.09,37.08) v1(44.09,36.08) v1(44.09,10.06) v1(45.09,59.1) v1(45.09,58.1) v1(45.09,57.1) v1(45.09,56.1) v1(45.09,55.09) v1(45.09,54.09) v1(45.09,53.09) v1(45.09,52.09) v1(45.09,51.09) v1(45.09,50.09) v1(45.09,49.09) v1(45.09,48.09) v1(45.09,47.09) v1(45.09,46.09) v1(45.09,45.09) v1(45.09,44.09) v1(45.09,43.09) v1(45.09,42.09) v1(45.09,41.08) v1(45.09,40.08) v1(45.09,39.08) v1(45.09,38.08) v1(45.09,37.08) v1(45.09,36.08) v1(45.09,14.06) v1(45.09,13.06) v1(46.09,59.1) v1(46.09,58.1) v1(46.09,57.1) v1(46.09,56.1) v1(46.09,55.09) v1(46.09,54.09) v1(46.09,53.09) v1(46.09,52.09) v1(46.09,51.09) v1(46.09,50.09) v1(46.09,49.09) v1(46.09,48.09) v1(46.09,47.09) v1(46.09,46.09) v1(46.09,45.09) v1(46.09,44.09) v1(46.09,43.09) v1(46.09,42.09) v1(46.09,41.08) v1(46.09,40.08) v1(46.09,39.08) v1(46.09,38.08) v1(46.09,37.08) v1(46.09,36.08) v1(46.09,14.06) v1(47.09,59.1) v1(47.09,58.1) v1(47.09,57.1) v1(47.09,56.1) v1(47.09,55.09) v1(47.09,54.09) v1(47.09,53.09) v1(47.09,52.09) v1(47.09,51.09) v1(47.09,50.09) v1(47.09,49.09) v1(47.09,48.09) v1(47.09,47.09) v1(47.09,46.09) v1(47.09,45.09) v1(47.09,44.09) v1(47.09,43.09) v1(47.09,42.09) v1(47.09,41.08) v1(47.09,40.08) v1(47.09,39.08) v1(47.09,38.08) v1(47.09,37.08) v1(47.09,36.08) v1(47.09,15.06) v1(47.09,14.06) v1(48.09,41.08) v1(48.09,40.08) v1(48.09,39.08) v1(48.09,38.08) v1(48.09,37.08) v1(48.09,36.08) v1(49.09,41.08) v1(49.09,40.08) v1(49.09,39.08) v1(49.09,38.08) v1(50.09,41.08) v1(50.09,40.08) v1(50.09,39.08) v1(50.09,38.08) v1(50.09,32.08) v1(51.09,41.08) v1(51.09,40.08) v1(51.09,39.08) v1(51.09,38.08) v1(51.09,14.06) v1(51.09,13.06) v1(53.09,8.06) v1(53.09,7.06) v1(53.99,40.08) v1(53.98,39.14) v1(53.99,38.19) v1(54.09,41.08) v1(55.1,41.08) v1(55.1,40.08) v1(55.1,15.06) v1(55.1,14.06) v1(56.1,41.08) v1(56.1,38.08) v1(56.1,15.06) v1(57.1,37.08) v1(57.1,15.06) v1(57.1,8.06) v1(58.1,41.08) v1(58.1,40.08) v1(58.1,39.08) v1(58.1,32.08) v1(58.1,31.08) v1(58.09,20.04) v1(58.1,19.07) v1(58.1,15.06) v1(58.1,14.06) v1(58.1,13.06) v1(58.1,12.06) v1(58.1,11.06) v1(59.1,41.08) v1(59.1,40.08) v1(59.1,39.08) v1(59.1,37.08) v1(59.1,36.08) v1(59.1,35.08) v1(59.1,32.08) v1(59.1,31.08) v1(59.1,30.08) v1(59.1,29.08) v1(59.1,28.07) v1(59.1,27.07) v1(59.1,26.07) v1(59.1,25.07) v1(59.1,8.06) v1(60.1,37.08) v1(60.1,36.08) v1(60.1,31.08) v1(60.1,30.08) v1(60.1,29.08) v1(60.1,28.07) v1(60.1,27.07) v1(60.1,26.07) v1(60.1,25.07) v1(60.1,23.07) v1(60.1,8.06) v1(61.1,31.08) v1(61.1,30.08) v1(61.1,29.08) v1(61.1,28.07) v1(61.1,27.07) v1(61.1,26.07) v1(61.1,25.07) v1(61.1,23.07) v1(61.1,22.07) v1(62.1,39.08) v1(62.1,38.08) v1(62.1,31.08) v1(62.1,30.08) v1(62.1,29.08) v1(62.1,28.07) v1(62.1,27.07) v1(62.1,26.07) v1(62.1,25.07) v1(62.1,23.07) v1(62.1,18.07) v1(63.1,41.08) v1(63.1,40.08) v1(63.1,35.08) v1(63.1,34.08) v1(63.1,33.08) v1(63.1,32.08) v1(63.1,31.08) v1(63.1,30.08) v1(63.1,29.08) v1(63.1,28.07) v1(63.1,22.07) v1(64.1,43.09) v1(64.1,34.08) v1(64.1,33.08) v1(64.1,32.08) v1(64.1,31.08) v1(64.1,30.08) v1(64.1,29.08) v1(64.1,28.07) v1(64.1,26.07) v1(64.1,23.07) v1(64.1,22.07) v1(65.1,49.09) v1(65.1,47.09) v1(65.1,46.09) v1(65.1,45.09) v1(65.1,44.09) v1(65.1,43.09) v1(65.1,42.09) v1(65.1,38.08) v1(65.1,37.08) v1(65.1,34.08) v1(65.1,33.08) v1(65.1,32.08) v1(65.1,31.08) v1(65.1,30.08) v1(65.1,29.08) v1(65.1,28.07) v1(65.1,23.07) v1(65.1,22.07) v1(65.1,5.06) v1(65.1,4.06) v1(65.1,3.06) v1(66.1,50.09) v1(66.1,49.09) v1(66.1,48.09) v1(66.1,47.09) v1(66.1,46.09) v1(66.1,45.09) v1(66.1,44.09) v1(66.1,43.09) v1(66.1,42.09) v1(66.1,41.08) v1(66.1,38.08) v1(66.1,37.08) v1(66.1,34.08) v1(66.1,33.08) v1(66.1,32.08) v1(66.1,31.08) v1(66.1,30.08) v1(66.1,13.06) v1(66.1,12.06) v1(66.1,11.06) v1(66.1,10.06) v1(66.1,9.06) v1(66.1,8.06) v1(66.1,7.06) v1(66.1,6.06) v1(66.1,5.06) v1(66.1,4.06) v1(66.1,3.06) v1(66.1,2.05) v1(67.1,48.09) v1(67.1,47.09) v1(67.1,46.09) v1(67.1,45.09) v1(67.1,44.09) v1(67.1,43.09) v1(67.1,42.09) v1(67.1,41.08) v1(67.1,40.08) v1(67.1,39.08) v1(67.1,38.08) v1(67.1,37.08) v1(67.1,36.08) v1(67.1,35.08) v1(67.1,34.08) v1(67.1,33.08) v1(67.1,26.07) v1(67.1,25.07) v1(67.1,16.07) v1(67.1,13.06) v1(67.1,12.06) v1(67.1,11.3) v1(67.1,10.06) v1(67.1,9.06) v1(67.1,8.06) v1(67.1,7.06) v1(67.1,6.06) v1(67.1,5.06) v1(67.1,4.06) v1(67.1,3.06) v1(68.11,48.09) v1(68.11,47.09) v1(68.11,46.09) v1(68.11,45.09) v1(68.11,44.09) v1(68.11,43.09) v1(68.11,42.09) v1(68.11,38.08) v1(68.11,37.08) v1(68.11,36.08) v1(68.11,35.08) v1(68.11,34.08) v1(68.11,33.08) v1(68.11,16.07) v1(68.11,13.06) v1(68.11,12.06) v1(68.11,11.06) v1(68.11,10.06) v1(68.11,9.06) v1(68.11,8.06) v1(68.11,7.06) v1(68.11,6.06) v1(68.11,5.06) v1(68.11,4.06) v1(68.11,3.06) v1(69.11,48.09) v1(69.11,47.09) v1(69.11,46.09) v1(69.11,45.09) v1(69.11,44.09) v1(69.11,43.09) v1(69.11,42.09) v1(69.11,38.08) v1(69.11,37.08) v1(69.11,36.08) v1(69.11,35.08) v1(69.11,34.08) v1(69.11,33.08) v1(69.11,29.08) v1(69.11,28.07) v1(69.11,27.07) v1(69.11,26.07) v1(69.11,25.07) v1(69.11,20.07) v1(69.11,19.07) v1(69.11,18.07) v1(69.11,16.07) v1(69.11,3.06) v1(70.11,48.09) v1(70.11,47.09) v1(70.11,46.09) v1(70.11,45.09) v1(70.11,44.09) v1(70.11,43.09) v1(70.11,42.09) v1(70.11,38.08) v1(70.11,37.08) v1(70.11,36.08) v1(70.11,35.08) v1(70.11,34.08) v1(70.11,26.07) v1(70.11,25.07) v1(70.11,19.07) v1(70.11,18.07) v1(70.11,16.07) v1(70.11,15.06) v1(70.11,14.06) v1(71.11,48.09) v1(71.11,47.09) v1(71.11,46.09) v1(71.11,45.09) v1(71.11,44.09) v1(71.11,43.09) v1(71.11,42.09) v1(71.11,38.08) v1(71.11,37.08) v1(71.11,36.08) v1(71.11,35.08) v1(71.11,32.08) v1(71.11,31.08) v1(71.11,30.08) v1(71.11,29.08) v1(71.11,26.07) v1(71.11,23.07) v1(71.11,22.07) v1(71.11,21.07) v1(71.11,18.07) v1(71.11,16.07) v1(71.11,15.06) v1(71.11,14.06) v1(72.11,48.09) v1(72.11,47.09) v1(72.11,46.09) v1(72.11,45.09) v1(72.11,44.09) v1(72.11,43.09) v1(72.11,42.09) v1(72.11,38.08) v1(72.11,37.08) v1(72.11,36.08) v1(72.11,35.08) v1(72.11,32.08) v1(72.11,31.08) v1(72.11,30.08) v1(72.11,24.07) v1(72.11,23.07) v1(72.11,22.07) v1(72.11,21.07) v1(72.11,18.07) v1(72.11,16.07) v1(73.11,48.09) v1(73.11,47.09) v1(73.11,46.09) v1(73.11,45.09) v1(73.11,44.09) v1(73.11,43.09) v1(73.11,42.09) v1(73.11,39.08) v1(73.11,38.08) v1(73.11,37.08) v1(73.11,36.08) v1(73.11,35.08) v1(73.11,32.08) v1(73.11,31.08) v1(73.11,30.08) v1(73.11,24.07) v1(73.11,23.07) v1(73.11,22.07) v1(73.11,16.07) v1(74.11,45.09) v1(74.11,44.09) v1(74.11,43.09) v1(74.11,42.09) v1(74.11,41.08) v1(74.11,40.08) v1(74.11,39.08) v1(74.11,38.08) v1(74.11,37.08) v1(74.11,36.08) v1(74.11,35.08) v1(74.11,32.08) v1(74.11,31.08) v1(74.11,30.08) v1(74.11,29.08) v1(74.11,25.07) v1(74.11,24.07) v1(74.11,23.07) v1(74.11,22.07) v1(74.11,16.07) v1(75.11,45.09) v1(75.11,44.09) v1(75.11,43.09) v1(75.11,42.09) v1(75.11,41.08) v1(75.11,40.08) v1(75.11,39.08) v1(75.11,38.08) v1(75.11,37.08) v1(75.11,36.08) v1(75.11,35.08) v1(75.11,32.08) v1(75.11,31.08) v1(75.11,30.08) v1(75.11,24.07) v1(75.11,23.07) v1(75.11,22.07) v1(75.11,21.07) v1(75.11,20.07) v1(75.11,19.07) v1(75.11,16.07) v1(75.11,15.06) v1(75.11,14.06) v1(75.11,13.06) v1(75.11,12.06) v1(76.11,32.08) v1(76.11,31.08) v1(76.11,17.07) v1(76.11,16.07) v1(77.11,32.08) v1(77.11,28.07) v1(77.11,27.07) v1(77.11,26.07) v1(77.11,17.07) v1(77.11,16.07) v1(77.11,9.06) v1(77.11,8.06) v1(77.11,7.06) v1(78.11,18.07) v1(78.11,17.07) v1(78.11,16.07) v1(79.11,15.06) v1(79.11,14.06) v1(79.11,13.06) v1(80.11,15.06) v1(80.11,14.06) v1(80.11,13.06) v1(80.11,12.06) v1(81.11,32.08) v1(81.11,31.08) v1(81.11,15.06) v1(81.11,14.06) v1(82.12,33.08) v1(82.12,32.08) v1(82.12,31.08) v1(82.12,24.07) v1(82.12,19.07) v1(82.12,18.07) v1(82.12,17.07) v1(82.12,16.07) v1(82.12,15.06) v1(82.12,14.06) v1(82.42,48.35) v1(82.42,47.53) v1(82.42,46.67) v1(82.42,45.85) v1(82.42,44.99) v1(82.42,44.2) v1(82.42,43.31) v1(82.93,49.02) v1(83.12,37.08) v1(83.12,36.08) v1(83.12,35.08) v1(83.12,34.08) v1(83.12,33.08) v1(83.12,32.08) v1(83.12,31.08) v1(83.12,24.07) v1(83.12,19.07) v1(83.12,18.07) v1(83.12,17.07) v1(83.12,16.07) v1(83.12,15.06) v1(83.9,49.02) v1(84.12,37.08) v1(84.12,36.08) v1(84.12,35.08) v1(84.12,34.08) v1(84.12,33.08) v1(84.12,32.08) v1(84.12,31.08) v1(84.12,10.06) v1(84.12,9.06) v1(84.12,7.06) v1(84.12,6.06) v1(84.12,5.06) v1(84.12,4.06) v1(84.12,3.06) v1(84.12,2.05) v1(84.12,1.05) v1(84.81,49.02) v1(85.12,39.08) v1(85.12,36.08) v1(85.12,35.08) v1(85.12,34.08) v1(85.12,33.08) v1(85.12,32.08) v1(85.12,31.08) v1(85.12,10.06) v1(86.12,49.09) v1(86.12,35.08) v1(86.12,34.08) v1(86.12,33.08) v1(86.12,32.08) v1(86.12,31.08) v1(87.12,34.08) v1(87.12,33.08) v1(87.12,32.08) v1(87.12,31.08) v1(87.12,10.06) v1(88.12,49.09) v1(88.12,35.08) v1(88.12,34.08) v1(88.12,33.08) v1(88.12,32.08) v1(88.12,31.08) v1(88.12,10.06) v1(88.12,6.06) v1(89.12,51.09) v1(89.12,50.09) v1(89.12,49.09) v1(89.12,39.08) v1(89.12,36.08) v1(89.12,35.08) v1(89.12,34.08) v1(89.12,33.08) v1(89.12,32.08) v1(89.12,31.08) v1(89.12,30.08) v1(89.12,10.06) v1(89.12,9.06) v1(89.12,8.06) v1(89.12,7.06) v1(89.12,6.06) v2(84.63,51.54) v2(85.55,51.54) v2(86.43,51.54)
GND: length 61.9
  Top Layer w0.305: U1.8 11.59,8 v1(9.7,8)
  Top Layer w0.508: U1.8 13.85,8.01 15.11,9.27 17.13,9.27 17.14,9.28 20.01,9.28 C1.2 21.09,9.33 26.21,14.45 28.75,14.45 31.55,17.25 36.6,17.25 v3(37.2,17.85)
  Top Layer w0.75: LEDB1.1 45.58,3.27 43.76,3.27 43.75,3.26 42.17,3.26
  Bottom Layer w0.254: v1(9.7,8) 9.44,8.25 9.44,12.91 4.57,17.78 4.57,21.84 U4.4
  Bottom Layer w0.305: U6.4 6.1,5.71 8.38,8 v1(9.7,8)
  vias: v2(51.94,18.29) v2(52.88,18.26) v3(34.2,19.85) v3(34.2,18.85) v3(35.2,18.85) v3(38.2,19.85) v3(38.2,18.85) v3(38.2,17.85) v3(39.2,27.85) v3(39.2,19.85) v3(39.2,18.85) v3(39.2,17.85) v3(39.55,31.6) v3(40.2,19.85) v3(40.2,18.85) v3(40.2,17.85) v3(41.2,31.85) v3(41.2,19.85) v3(41.2,18.85) v3(41.2,17.85) v3(44.2,26.85) v3(44.2,25.85) v3(44.2,24.85) v3(44.2,23.85) v3(45.2,26.85) v3(45.2,25.85) v3(45.2,24.85) v3(46.2,26.85) v3(46.2,25.85) v3(46.2,22.85) v3(47.2,26.85) v3(47.2,25.85) v3(47.2,22.85) v3(48.2,31.85) v3(49.2,31.85) v3(49.2,30.85) v3(49.2,29.85) v3(49.2,28.85) v3(50.2,30.85) v3(50.2,29.85) v3(50.2,28.85) v3(51.2,30.85) v3(51.2,29.85) v3(51.2,28.85) v3(51.2,25.85) v3(54.2,22.85) v3(54.2,21.85) v3(55.2,29.85) v3(55.2,28.85) v3(55.2,27.85) v3(55.2,26.85) v3(55.2,25.85) v3(55.2,22.85) v3(55.2,21.85) v3(55.2,17.85) v3(56.2,28.85) v3(56.2,27.85) v3(56.2,26.85) v3(56.2,25.85) v3(56.2,22.85) v3(56.2,21.85)
VIN+: length 81.5
  Top Layer w0.254: v1(71.63,19.94) 71.66,19.91 U18.3 ; R56.1 78.64,25.16 v1(78.77,25.16) ; R42.2 81.03,23.88
  Top Layer w0.305: R14.1 v1(80.14,31.5)
  Top Layer w0.75: R42.2 80.98,24.22 v3(80.98,25.37) ; U25.6 81.34,23.4 80.86,23.88
  Inner1 w0.305: v1(80.14,31.5) 78.99,31.5 72.77,25.27 71.88,25.27 69.98,23.37 69.98,20.95 70.99,19.94 v1(71.63,19.94)
  Inner2 w0.254: v1(78.77,25.16) 76.98,25.16 75.95,24.13 75.95,18.54 74.46,17.06 33.72,17.06 v1(32.5,18.27)
  vias: v1(85.78,24.99) v1(85.79,24.11) v1(87.07,24.99) v1(87.06,24.11) v1(88.33,24.99) v1(88.33,24.11) v3(78.98,27.37) v3(79.98,27.37) v3(79.98,26.37) v3(79.98,25.37) v3(80.98,27.37) v3(80.98,26.37) v3(81.98,27.37) v3(81.98,26.37) v3(81.98,25.37) v3(82.98,29.37) v3(82.98,28.37) v3(82.98,27.37) v3(82.98,26.37) v3(82.98,25.37) v3(83.98,29.37) v3(83.98,28.37) v3(83.98,27.37) v3(83.98,26.37) v3(83.98,25.37) v3(84.98,29.37) v3(84.98,28.37) v3(84.98,27.37) v3(84.98,26.37) v3(84.98,25.37) v3(85.98,29.37) v3(85.98,28.37) v3(85.98,27.37) v3(85.98,26.37) v3(86.98,29.37) v3(86.98,28.37) v3(86.98,27.37) v3(86.98,26.37) v3(87.98,29.37) v3(87.98,28.37) v3(87.98,27.37) v3(87.98,26.37)
CAN_H: length 5.9
  Top Layer w0.254: U1.7 11.5,9.19 R1.2 8.04,9.38 U2.2
CAN_L: length 5.8
  Top Layer w0.254: U1.6 11.45,10.69 R1.1 8.16,10.63 U2.1
CAN_RX: length 30
  Top Layer w0.254: v1(18.92,11.81) 18.92,11.82 17.14,11.82 ; v1(38.99,23.75) 39.1,23.64 40.75,23.64
  Inner1 w0.254: v1(18.92,11.81) 20.62,10.11 21.72,10.11 35.18,23.57 38.38,23.57 38.56,23.75 v1(38.99,23.75)
CAN_TX: length 30
  Top Layer w0.254: 17.14,8.01 18.92,8.01 v1(18.92,8) ; v1(38.99,22.99) 39.14,23.14 40.75,23.14
  Inner1 w0.254: v1(38.99,22.99) 38.56,22.99 38.38,23.16 35.35,23.16 21.89,9.7 20.62,9.7 v1(18.92,8)
CAP_C: length 29.4
  Top Layer w0.254: v1(47.75,30.48) 47.71,30.44 47.71,29.1 ; R11.2 22.1,32.25 C25.1 23.56,30.54 v1(23.62,30.48)
  Inner1 w0.254: v1(23.62,30.48) 24.13,30.99 47.24,30.99 v1(47.75,30.48)
CAP_I+: length 20.4
  Top Layer w0.305: U17.2 10.47,31.82 10.41,31.88 ; v1(3.3,43.31) R15.2
  Inner1 w0.305: v1(10.41,32.03) 9.96,32.03 9.66,31.74 9.53,31.74 9.4,31.88 9.4,39.12 5.55,42.96 4.1,42.96 3.76,43.31 v1(3.3,43.31)
  vias: v1(14.1,52.57) v3(1.18,54.8) v3(1.18,53.8) v3(1.18,52.8) v3(1.18,51.8) v3(1.18,50.8) v3(1.18,49.8) v3(1.18,48.8) v3(1.18,47.8) v3(1.18,46.8) v3(2.18,54.8) v3(2.18,53.8) v3(2.18,52.8) v3(2.18,51.8) v3(2.18,50.8) v3(2.18,49.8) v3(2.18,48.8) v3(2.18,47.8) v3(3.18,54.8) v3(3.18,53.8) v3(3.18,52.8) v3(3.18,51.8) v3(3.18,50.8) v3(3.18,49.8) v3(3.18,48.8) v3(3.18,47.8) v3(4.18,55.8) v3(4.18,54.8) v3(4.18,53.8) v3(4.18,52.8) v3(4.18,51.8) v3(4.18,50.8) v3(4.18,49.8) v3(4.18,48.8) v3(4.18,47.8) v3(5.18,58.8) v3(5.18,57.8) v3(5.18,56.8) v3(5.18,55.8) v3(5.18,54.8) v3(5.18,53.8) v3(5.18,52.8) v3(5.18,51.8) v3(5.18,50.8) v3(5.18,49.8) v3(5.18,48.8) v3(5.18,47.8) v3(6.18,58.8) v3(6.18,57.8) v3(6.18,56.8) v3(6.18,55.8) v3(6.18,54.8) v3(6.18,53.8) v3(6.18,52.8) v3(6.18,51.8) v3(6.18,50.8) v3(6.18,49.8) v3(6.18,48.8) v3(6.18,47.8) v3(6.18,46.8) v3(6.18,45.8) v3(7.18,58.8) v3(7.18,57.8) v3(7.18,56.8) v3(7.18,55.8) v3(7.18,54.8) v3(7.18,53.8) v3(7.18,52.8) v3(7.18,51.8) v3(7.18,50.8) v3(7.18,49.8) v3(7.18,48.8) v3(7.18,47.8) v3(7.18,46.8) v3(7.18,45.8) v3(8.18,58.8) v3(8.18,57.8) v3(8.18,56.8) v3(8.18,55.8) v3(8.18,54.8) v3(8.18,53.8) v3(8.18,52.8) v3(8.18,51.8) v3(8.18,50.8) v3(8.18,49.8) v3(8.18,48.8) v3(8.18,47.8) v3(8.18,46.8) v3(8.18,45.8) v3(8.18,44.8) v3(9.18,58.8) v3(9.18,57.8) v3(9.18,56.8) v3(9.18,55.8) v3(9.18,54.8) v3(9.18,53.8) v3(9.18,52.8) v3(9.18,51.8) v3(9.18,50.8) v3(9.18,49.8) v3(9.18,48.8) v3(9.18,47.8) v3(9.18,46.8) v3(9.18,45.8) v3(9.18,44.8) v3(9.18,43.8) v3(9.18,42.8) v3(10.18,58.8) v3(10.18,57.8) v3(10.18,56.8) v3(10.18,55.8) v3(10.18,54.8) v3(10.18,53.8) v3(10.18,52.8) v3(10.18,51.8) v3(10.18,50.8) v3(10.18,49.8) v3(10.18,48.8) v3(10.18,47.8) v3(10.18,46.8) v3(10.18,45.8) v3(10.18,44.8) v3(10.18,43.8) v3(10.18,42.8) v3(11.18,58.8) v3(11.18,57.8) v3(11.18,56.8) v3(11.18,55.8) v3(11.18,54.8) v3(11.18,53.8) v3(11.18,52.8) v3(11.18,51.8) v3(11.18,50.8) v3(11.18,49.8) v3(11.18,48.8) v3(11.18,47.8) v3(11.18,46.8) v3(11.18,45.8) v3(11.18,44.8) v3(11.18,43.8) v3(11.18,42.8) v3(12.18,58.8) v3(12.18,57.8) v3(12.18,56.8) v3(12.18,55.8) v3(12.18,54.8) v3(12.18,53.8) v3(12.18,52.8) v3(12.18,51.8) v3(12.18,50.8) v3(12.18,49.8) v3(12.18,48.8) v3(12.18,47.8) v3(12.18,46.8) v3(12.18,45.8) v3(12.18,44.8) v3(12.18,43.8) v3(12.18,42.8) v3(13.18,58.8) v3(13.18,57.8) v3(13.18,56.8) v3(13.18,55.8) v3(13.18,54.8) v3(13.18,53.8) v3(13.18,52.8) v3(14.18,53.8) v3(15.18,53.8) v3(15.18,52.8) v3(17.18,58.8) v3(17.18,57.8) v3(17.18,56.8) v3(17.18,55.8) v3(17.18,54.8) v3(18.18,58.8) v3(18.18,57.8) v3(18.18,56.8) v3(18.18,55.8) v3(18.18,54.8) v3(19.18,58.8) v3(19.18,57.8) v3(19.18,56.8) v3(19.18,55.8) v3(19.18,54.8) v3(20.18,58.8) v3(20.18,57.8) v3(20.18,56.8) v3(20.18,55.8) v3(20.18,54.8) v3(21.18,58.8) v3(21.18,57.8) v3(21.18,56.8) v3(21.18,55.8) v3(21.18,54.8) v3(22.18,58.8) v3(22.18,57.8) v3(22.18,56.8) v3(22.18,55.8) v3(22.18,54.8) v3(23.18,58.8) v3(23.18,57.8) v3(23.18,56.8) v3(23.18,55.8) v3(23.18,54.8) v3(23.18,53.8) v3(24.18,58.8) v3(24.18,57.8) v3(24.18,56.8) v3(24.18,55.8) v3(24.18,54.8) v3(24.18,53.8) v3(24.18,52.8) v3(25.18,58.8) v3(25.18,57.8) v3(26.18,58.8) v3(26.18,57.8) v3(27.18,58.8) v3(27.18,57.8) v3(28.18,58.8) v3(28.18,57.8) v3(29.18,58.8) v3(29.18,57.8)
CAP_I-: length 46.2
  Top Layer w0.305: U17.3 10.6,31.17 v1(10.41,30.99) ; R24.2 11.83,18.4 v1(11.81,18.41) ; R15.1 v1(3.3,42.16)
  Inner1 w0.305: v1(3.3,42.16) 3.76,42.16 4.1,42.51 5.25,42.51 8.89,38.86 8.89,31.62 9.2,31.31 9.29,31.31 9.32,31.28 9.66,31.28 9.96,30.99 v1(10.41,30.99)
  Bottom Layer w0.305: 3.17,34.88 6.01,34.88 7.11,33.78 7.11,18.8 7.49,18.41 v1(11.81,18.41)
  vias: v3(1.05,39.69) v3(1.05,38.69) v3(1.05,37.69) v3(1.05,36.69) v3(1.05,35.69) v3(2.05,37.69) v3(2.05,36.69) v3(3.05,37.69) v3(3.05,36.69) v3(4.05,37.69) v3(4.05,36.69) v3(4.05,35.69) v3(5.05,37.69) v3(5.05,36.69) v3(5.05,35.69) v3(5.05,34.69) v3(6.05,39.69) v3(6.05,38.69) v3(6.05,37.69) v3(6.05,36.69) v3(6.05,35.69) v3(6.05,34.69) v3(6.05,33.69) v3(7.05,38.69) v3(7.05,37.69) v3(7.05,36.69) v3(7.05,35.69) v3(8.05,36.69) v3(8.05,35.69)
CAP_V: length 35.4
  Top Layer w0.254: v1(45.97,27.69) 46.36,27.69 46.71,28.04 U5.27
  Top Layer w0.5: 16.39,22.84 16.39,24.57 C52.2
  Inner1 w0.254: v1(45.97,27.69) 43.94,27.69 43.05,28.57 29.46,28.57 25.53,24.64 v1(16.38,24.64)
CAP_V+: length 1.7
  Top Layer w0.5: R21.1 16.36,18.4 R24.1
CAP_V-: length 1.8
  Top Layer w0.5: R19.1 16.33,19.92 R28.1
CHA1: length 19.9
  Top Layer w0.254: 45.7,29.09 45.7,30.53 47.05,31.88 v1(47.24,31.88) R38.2 ; 61.51,32.63 61.5,32.64 v1(59.94,32.64)
  Inner1 w0.254: v1(59.94,32.64) 59.51,32.64 59.08,33.07 47.17,33.07 46.74,32.64 46.74,31.97 46.83,31.88 v1(47.24,31.88)
CHA2: length 20
  Top Layer w0.254: 45.21,29.1 45.21,31.27 R39.2 ; v1(59.94,33.91) 59.96,33.9 61.51,33.9
  Inner1 w0.254: v1(45.85,31.88) 46.24,31.88 46.33,31.97 46.33,32.81 47,33.48 59.08,33.48 59.51,33.91 v1(59.94,33.91)
CHB1: length 22
  Top Layer w0.254: U19.5 29.96,36.44 v1(29.97,36.45) ; 44.71,29.18 44.71,31.49 v1(44.32,31.88)
  Inner1 w0.254: v1(29.97,36.45) 30.4,36.45 32.05,34.8 42.87,34.8 43.71,33.95 43.71,31.97 43.8,31.88 v1(44.32,31.88)
CHB2: length 21.9
  Top Layer w0.254: 44.21,29.18 44.21,30.67 43.03,31.85 R37.2 ; v1(29.97,35.18) 29.96,35.17 U19.6
  Inner1 w0.254: v1(42.67,31.88) 43.22,31.88 43.31,31.97 43.31,33.78 42.67,34.42 31.88,34.42 30.73,35.56 30.35,35.56 v1(29.97,35.18)
HSA: length 19.3
  Top Layer w0.5: U19.4 35.38,36.44 C46.2
  Top Layer w0.75: C46.2 36.07,49.79 L8.1
  Top Layer w1.27: 32.11,58.27 34.15,58.27
  vias: v3(28.53,43.57) v3(29.53,43.57) v3(29.53,42.57) v3(30.53,43.57) v3(30.53,42.57) v3(31.53,51.57) v3(31.53,50.57) v3(31.53,43.57) v3(31.53,42.57) v3(32.53,51.57) v3(32.53,50.57) v3(32.53,43.57) v3(32.53,42.57) v3(33.53,56.57) v3(33.53,55.57) v3(33.53,54.57) v3(33.53,53.57) v3(33.53,52.57) v3(33.53,51.57) v3(33.53,50.57) v3(33.53,49.57) v3(33.53,48.57) v3(33.53,47.57) v3(33.53,46.57) v3(33.53,45.57) v3(33.53,44.57) v3(33.53,43.57) v3(33.53,42.57) v3(34.53,58.57) v3(34.53,42.57) v3(35.53,58.57) v3(35.53,42.57) v3(36.53,58.57) v3(36.53,42.57) v3(37.53,58.57) v3(37.53,42.57) v3(38.53,58.57) v3(38.53,42.57) v3(39.53,58.57) v3(39.53,57.57) v3(39.53,56.57) v3(39.53,55.57) v3(39.53,54.57) v3(39.53,53.57) v3(39.53,52.57) v3(39.53,51.57) v3(39.53,50.57) v3(39.53,49.57) v3(39.53,48.57) v3(39.53,47.57) v3(39.53,46.57) v3(39.53,45.57) v3(39.53,44.57) v3(39.53,43.57) v3(39.53,42.57) v3(40.53,58.57) v3(40.53,57.57) v3(40.53,56.57) v3(40.53,55.57) v3(40.53,54.57) v3(40.53,53.57) v3(40.53,52.57) v3(40.53,51.57) v3(40.53,50.57) v3(40.53,49.57) v3(40.53,48.57) v3(40.53,47.57) v3(40.53,46.57) v3(40.53,45.57) v3(40.53,44.57) v3(40.53,43.57) v3(40.53,42.57)
HSB: length 20.6
  Top Layer w0.305: 55.97,32.63 55.44,32.63
  Top Layer w0.75: L8.2 52.7,49.82 52.7,34.42 52.77,34.35 C47.1 53.72,33.4 54.5,32.63 55.44,32.63
  vias: v3(48.85,58.57) v3(48.85,57.57) v3(48.85,56.57) v3(48.85,55.57) v3(48.85,54.57) v3(48.85,53.57) v3(48.85,52.57) v3(48.85,51.57) v3(48.85,50.57) v3(48.85,49.57) v3(48.85,48.57) v3(48.85,47.57) v3(48.85,46.57) v3(48.85,45.57) v3(48.85,44.57) v3(48.85,43.57) v3(48.85,42.57) v3(49.85,58.57) v3(49.85,57.57) v3(49.85,56.57) v3(49.85,55.57) v3(49.85,54.57) v3(49.85,53.57) v3(49.85,52.57) v3(49.85,51.57) v3(49.85,50.57) v3(49.85,49.57) v3(49.85,48.57) v3(49.85,47.57) v3(49.85,46.57) v3(49.85,45.57) v3(49.85,44.57) v3(49.85,43.57) v3(49.85,42.57) v3(50.85,58.57) v3(50.85,42.57) v3(51.85,58.57) v3(51.85,42.57) v3(52.85,58.57) v3(52.85,42.57) v3(53.85,58.57) v3(53.85,42.57) v3(54.85,58.57) v3(54.85,42.57) v3(55.85,42.57) v3(56.85,52.57) v3(56.85,51.57) v3(56.85,50.57) v3(56.85,49.57) v3(56.85,43.57) v3(56.85,42.57) v3(57.85,50.57) v3(57.85,49.57) v3(57.85,43.57) v3(57.85,42.57) v3(58.85,50.57) v3(58.85,49.57) v3(58.85,43.57) v3(58.85,42.57) v3(59.74,50.52) v3(59.85,49.57) v3(59.85,43.57) v3(59.85,42.57) v3(60.85,43.57) v3(60.85,42.57)
ID_IN: length 5.7
  Top Layer w0.75: 87.07,20.25 81.35,20.25 U25.4
  vias: v3(84.74,15.59) v3(84.74,14.59) v3(85.74,15.59) v3(86.74,16.59) v3(86.74,15.59) v3(87.74,16.59) v3(87.74,15.59) v3(88.74,16.59) v3(88.74,15.59) v3(88.74,14.59) v3(88.74,13.59) v3(88.74,12.59) v3(88.74,11.59) v4(81.41,3.68) v4(81.41,3.05) v4(81.41,2.41) v4(82.03,3.68) v4(82.04,3.05) v4(82.04,2.41) v4(82.7,3.68) v4(82.68,3.05) v4(82.68,2.41)
IN_C: length 19.5
  Top Layer w0.254: v2(48.26,19.3) 47.63,19.3 47.21,19.72 U5.11 ; R12.2 64.72,20.26 C26.1
  Inner2 w0.254: v2(62.99,20.32) 62.48,20.83 51.82,20.83 50.29,19.3 v2(48.26,19.3)
IN_V: length 21.4
  Top Layer w0.254: v1(46.74,22.1) 46.71,22.07 46.71,20.63
  Top Layer w0.75: v1(29.46,22.97) 29.46,24.57 C53.2
  Inner2 w0.254: v1(29.46,22.97) 31.09,21.34 45.97,21.34 v1(46.74,22.1)
INC-: length 68.2
  Top Layer w0.305: U16.2 71.45,27.51 v1(71.25,27.3) ; v1(71.6,19.18) 73.19,19.18 U18.2 ; R14.2 v1(80.14,32.51) ; R13.2 v1(87.5,50.93)
  Inner1 w0.254: v1(71.25,27.3) 70.82,27.3 70.51,27.61 70.21,27.61 69.89,27.94 69.89,32.36 71.33,33.81 81.03,33.81 81.28,34.06 81.28,48.89 82.93,50.55 86.69,50.55 87.07,50.93 v1(87.5,50.93)
  Inner1 w0.305: v1(71.6,19.18) 71.18,19.18 69.57,20.79 69.57,23.54 71.71,25.68 72.54,25.68 79.38,32.51 v1(80.14,32.51)
  vias: v3(65.49,58.18) v3(65.49,57.18) v3(65.49,56.18) v3(65.49,55.18) v3(65.49,54.18) v3(65.49,53.18) v3(65.49,52.18) v3(66.49,58.18) v3(66.49,57.18) v3(66.49,56.18) v3(66.49,55.18) v3(66.49,54.18) v3(66.49,53.18) v3(66.49,52.18) v3(67.49,58.18) v3(67.49,57.18) v3(67.49,56.18) v3(67.49,55.18) v3(67.49,54.18) v3(68.49,58.18) v3(68.49,57.18) v3(68.49,56.18) v3(68.49,55.18) v3(68.49,54.18) v3(69.49,58.18) v3(69.49,57.18) v3(69.49,56.18) v3(69.49,55.18) v3(69.49,54.18) v3(70.49,58.18) v3(70.49,57.18) v3(70.49,56.18) v3(70.49,55.18) v3(70.49,54.18) v3(71.49,58.18) v3(71.49,57.18) v3(71.49,56.18) v3(71.49,55.18) v3(71.49,54.18) v3(72.49,58.18) v3(72.49,57.18) v3(72.49,56.18) v3(72.49,55.18) v3(72.49,54.18) v3(73.49,58.18) v3(73.49,57.18) v3(73.49,56.18) v3(73.49,55.18) v3(73.49,54.18) v3(74.49,54.18) v3(74.49,53.18) v3(74.49,52.18) v3(75.49,54.18) v3(75.49,53.18) v3(75.49,52.18) v3(76.49,58.18) v3(76.49,57.18) v3(76.49,56.18) v3(76.49,55.18) v3(76.49,54.18) v3(76.49,53.18) v3(76.49,52.18) v3(77.49,58.18) v3(77.49,57.18) v3(77.49,56.18) v3(77.49,55.18) v3(77.49,54.18) v3(77.49,53.18) v3(77.49,52.18) v3(77.49,51.18) v3(77.49,50.18) v3(77.49,49.18) v3(77.49,48.18) v3(77.49,47.18) v3(77.49,46.18) v3(77.49,45.18) v3(77.49,44.18) v3(77.49,43.18) v3(77.49,42.18) v3(77.49,38.18) v3(77.49,37.18) v3(77.49,36.18) v3(77.49,35.18) v3(78.49,58.18) v3(78.49,57.18) v3(78.49,56.18) v3(78.49,55.18) v3(78.49,54.18) v3(78.49,53.18) v3(78.49,52.18) v3(78.49,51.18) v3(78.49,50.18) v3(78.49,49.18) v3(78.49,48.18) v3(78.49,47.18) v3(78.49,46.18) v3(78.49,45.18) v3(78.49,44.18) v3(78.49,43.18) v3(78.49,42.18) v3(78.49,38.18) v3(78.49,37.18) v3(79.49,58.18) v3(79.49,57.18) v3(79.49,56.18) v3(79.49,55.18) v3(79.49,54.18) v3(79.49,53.18) v3(79.49,52.18) v3(79.49,51.18) v3(79.49,50.18) v3(79.49,49.18) v3(79.49,48.18) v3(79.49,47.18) v3(79.49,46.18) v3(79.49,45.18) v3(79.49,44.18) v3(79.49,43.18) v3(79.49,42.18) v3(79.49,38.18) v3(79.49,37.18) v3(79.49,36.18) v3(80.49,58.18) v3(80.49,57.18) v3(80.49,56.18) v3(80.49,55.18) v3(80.49,54.18) v3(80.49,53.18) v3(80.49,52.18) v3(80.49,51.18) v3(80.49,50.18) v3(80.49,49.18) v3(80.49,48.18) v3(80.49,47.18) v3(80.49,46.18) v3(80.49,45.18) v3(80.49,44.18) v3(80.49,43.18) v3(80.49,42.18) v3(80.49,38.18) v3(80.49,37.18) v3(80.49,36.18) v3(81.49,58.18) v3(81.49,57.18) v3(81.49,56.18) v3(81.49,55.18) v3(81.49,54.18) v3(81.49,53.18) v3(81.49,52.18) v3(81.49,51.18) v3(82.49,58.18) v3(82.49,57.18) v3(82.49,56.18) v3(82.49,55.18) v3(82.49,54.18) v3(82.49,53.18) v3(82.49,52.18) v3(83.49,58.18) v3(83.49,57.18) v3(83.49,56.18) v3(83.49,55.18) v3(83.49,54.18) v3(83.49,53.18) v3(84.49,58.18) v3(84.49,57.18) v3(84.49,56.18) v3(84.49,55.18) v3(84.49,54.18) v3(84.49,53.18) v3(85.49,58.18) v3(85.49,57.18) v3(85.49,56.18) v3(85.49,55.18)
